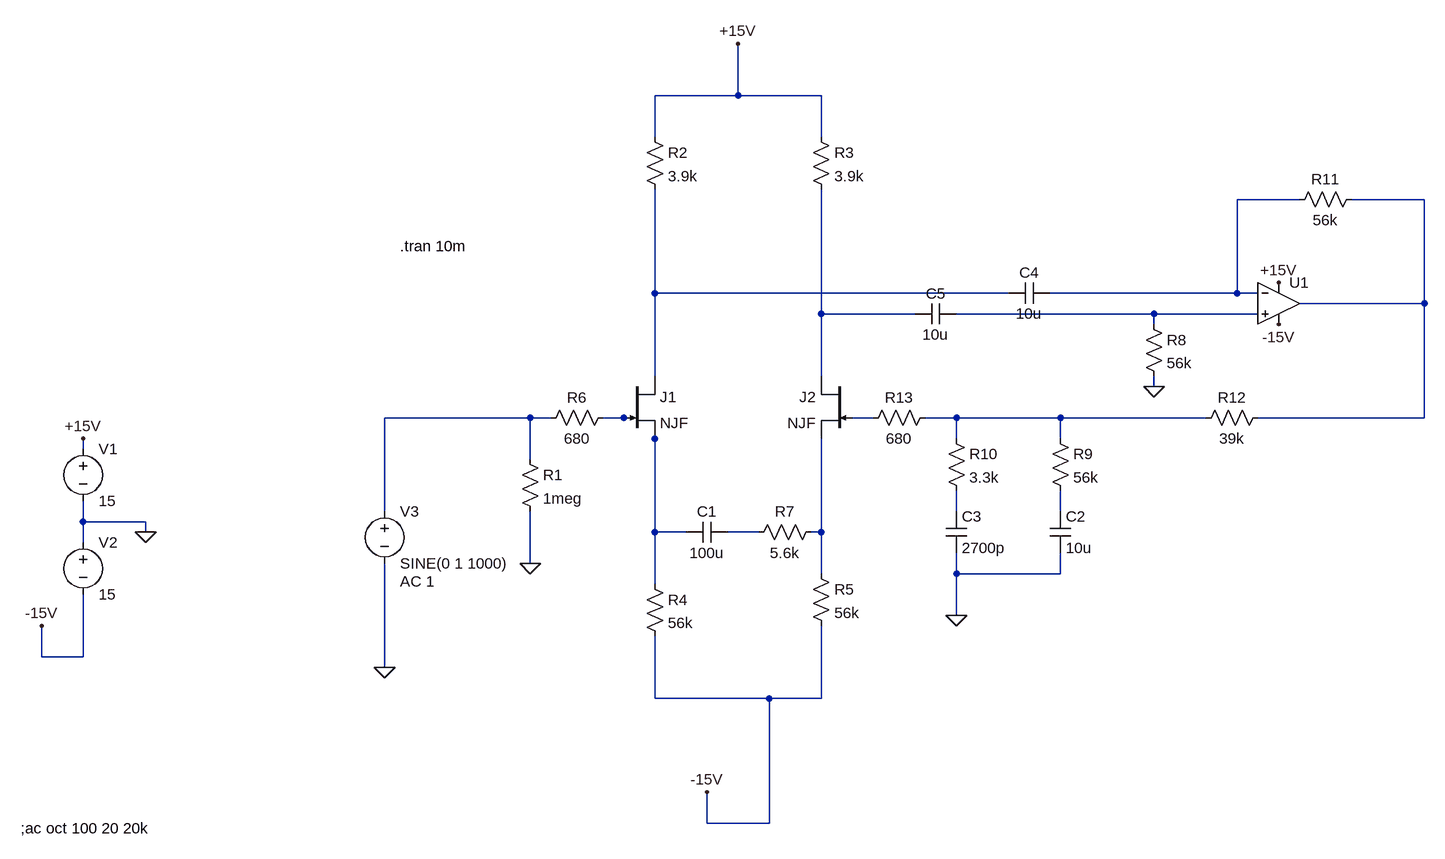
[diagram p0: schematic AP046_input.asc]
AP046_input.asc, the LTspice schematic file:
Version 4
SHEET 1 2104 680
WIRE 1040 -464 1040 -544
WIRE 1040 -464 912 -464
WIRE 1168 -464 1040 -464
WIRE 912 -400 912 -464
WIRE 1168 -400 1168 -464
WIRE 1904 -304 1808 -304
WIRE 2096 -304 1984 -304
WIRE 912 -160 912 -320
WIRE 1456 -160 912 -160
WIRE 1808 -160 1808 -304
WIRE 1808 -160 1520 -160
WIRE 1840 -160 1808 -160
WIRE 2096 -144 2096 -304
WIRE 2096 -144 1904 -144
WIRE 1168 -128 1168 -320
WIRE 1312 -128 1168 -128
WIRE 1680 -128 1376 -128
WIRE 1840 -128 1680 -128
WIRE 1680 -112 1680 -128
WIRE 912 -32 912 -160
WIRE 1168 -32 1168 -128
WIRE 1680 -16 1680 -32
WIRE 720 32 496 32
WIRE 752 32 720 32
WIRE 864 32 832 32
WIRE 880 32 864 32
WIRE 1248 32 1216 32
WIRE 1376 32 1328 32
WIRE 1536 32 1376 32
WIRE 1760 32 1536 32
WIRE 2096 32 2096 -144
WIRE 2096 32 1840 32
WIRE 912 64 912 48
WIRE 1376 64 1376 32
WIRE 1536 64 1536 32
WIRE 32 80 32 64
WIRE 720 96 720 32
WIRE 496 176 496 32
WIRE 1376 176 1376 144
WIRE 1536 176 1536 144
WIRE 32 192 32 160
WIRE 128 192 32 192
WIRE 128 208 128 192
WIRE 912 208 912 64
WIRE 960 208 912 208
WIRE 1072 208 1024 208
WIRE 1168 208 1168 64
WIRE 1168 208 1152 208
WIRE 32 224 32 192
WIRE 720 256 720 176
WIRE 1168 272 1168 208
WIRE 1376 272 1376 240
WIRE 1536 272 1536 240
WIRE 1536 272 1376 272
WIRE 912 288 912 208
WIRE 1376 336 1376 272
WIRE -32 400 -32 352
WIRE 32 400 32 304
WIRE 32 400 -32 400
WIRE 496 416 496 256
WIRE 912 464 912 368
WIRE 1088 464 912 464
WIRE 1168 464 1168 352
WIRE 1168 464 1088 464
WIRE 992 656 992 608
WIRE 1088 656 1088 464
WIRE 1088 656 992 656
FLAG 128 208 0
FLAG 32 64 +15V
FLAG -32 352 -15V
FLAG 720 256 0
FLAG 1040 -544 +15V
FLAG 992 608 -15V
FLAG 1376 336 0
FLAG 1680 -16 0
FLAG 496 416 0
FLAG 1872 -176 +15V
FLAG 1872 -112 -15V
SYMBOL voltage 32 64 R0
WINDOW 123 0 0 Left 2
WINDOW 39 0 0 Left 2
SYMATTR InstName V1
SYMATTR Value 15
SYMBOL voltage 32 208 R0
WINDOW 123 0 0 Left 2
WINDOW 39 0 0 Left 2
SYMATTR InstName V2
SYMATTR Value 15
SYMBOL voltage 496 160 R0
WINDOW 123 24 124 Left 2
WINDOW 39 0 0 Left 2
SYMATTR Value2 AC 1
SYMATTR InstName V3
SYMATTR Value SINE(0 1 1000)
SYMBOL njf 864 -32 R0
SYMATTR InstName J1
SYMBOL njf 1216 -32 M0
SYMATTR InstName J2
SYMBOL res 704 80 R0
SYMATTR InstName R1
SYMATTR Value 1meg
SYMBOL res 896 -416 R0
SYMATTR InstName R2
SYMATTR Value 3.9k
SYMBOL res 1152 -416 R0
SYMATTR InstName R3
SYMATTR Value 3.9k
SYMBOL res 896 272 R0
SYMATTR InstName R4
SYMATTR Value 56k
SYMBOL res 1152 256 R0
SYMATTR InstName R5
SYMATTR Value 56k
SYMBOL res 848 16 R90
WINDOW 0 0 56 VBottom 2
WINDOW 3 32 56 VTop 2
SYMATTR InstName R6
SYMATTR Value 680
SYMBOL res 1168 192 R90
WINDOW 0 0 56 VBottom 2
WINDOW 3 32 56 VTop 2
SYMATTR InstName R7
SYMATTR Value 5.6k
SYMBOL cap 1024 192 R90
WINDOW 0 0 32 VBottom 2
WINDOW 3 32 32 VTop 2
SYMATTR InstName C1
SYMATTR Value 100u
SYMBOL res 1664 -128 R0
SYMATTR InstName R8
SYMATTR Value 56k
SYMBOL res 2000 -320 R90
WINDOW 0 0 56 VBottom 2
WINDOW 3 32 56 VTop 2
SYMATTR InstName R11
SYMATTR Value 56k
SYMBOL res 1520 48 R0
SYMATTR InstName R9
SYMATTR Value 56k
SYMBOL res 1360 48 R0
SYMATTR InstName R10
SYMATTR Value 3.3k
SYMBOL cap 1520 176 R0
SYMATTR InstName C2
SYMATTR Value 10u
SYMBOL cap 1360 176 R0
SYMATTR InstName C3
SYMATTR Value 2700p
SYMBOL res 1856 16 R90
WINDOW 0 0 56 VBottom 2
WINDOW 3 32 56 VTop 2
SYMATTR InstName R12
SYMATTR Value 39k
SYMBOL res 1344 16 R90
WINDOW 0 0 56 VBottom 2
WINDOW 3 32 56 VTop 2
SYMATTR InstName R13
SYMATTR Value 680
SYMBOL Opamps\\UniversalOpamp2 1872 -144 R0
SYMATTR InstName U1
SYMBOL cap 1520 -176 R90
WINDOW 0 0 32 VBottom 2
WINDOW 3 32 32 VTop 2
SYMATTR InstName C4
SYMATTR Value 10u
SYMBOL cap 1376 -144 R90
WINDOW 0 0 32 VBottom 2
WINDOW 3 32 32 VTop 2
SYMATTR InstName C5
SYMATTR Value 10u
TEXT -64 664 Left 2 !;ac oct 100 20 20k
TEXT 520 -232 Left 2 !.tran 10m

The netlist it stands for:
* AP046_input.asc
V1 +15V 0 15
V2 0 -15V 15
V3 N006 0 SINE(0 1 1000) AC 1
J1 N003 N007 N010 NJF
J2 N004 N008 N014 NJF
R1 N006 0 1meg
R2 +15V N003 3.9k
R3 +15V N004 3.9k
R4 N010 -15V 56k
R5 N014 -15V 56k
R6 N007 N006 680
R7 N014 N013 5.6k
C1 N013 N010 100u
R8 N005 0 56k
R11 N002 N001 56k
R9 N009 N012 56k
R10 N009 N011 3.3k
C2 N012 0 10u
C3 N011 0 2700p
R12 N002 N009 39k
R13 N009 N008 680
XU1 N005 N001 +15V -15V N002 level.2 Avol=1Meg GBW=10Meg Slew=10Meg ilimit=25m rail=0 Vos=0 phimargin=45 en=0 enk=0 in=0 ink=0 Rin=500Meg  ; pins IN+ IN- V+ V- OUT
C4 N001 N003 10u
C5 N005 N004 10u
.model NJF NJF
.model PJF PJF
.lib standard.jft
;ac oct 100 20 20k
.tran 10m
.lib UniversalOpamps2.sub
.backanno
.end